# Altium schematic sheet Channel.SchDoc
size A4; DocumentNumber: 3; SheetNumber: 3; SheetTotal: 10
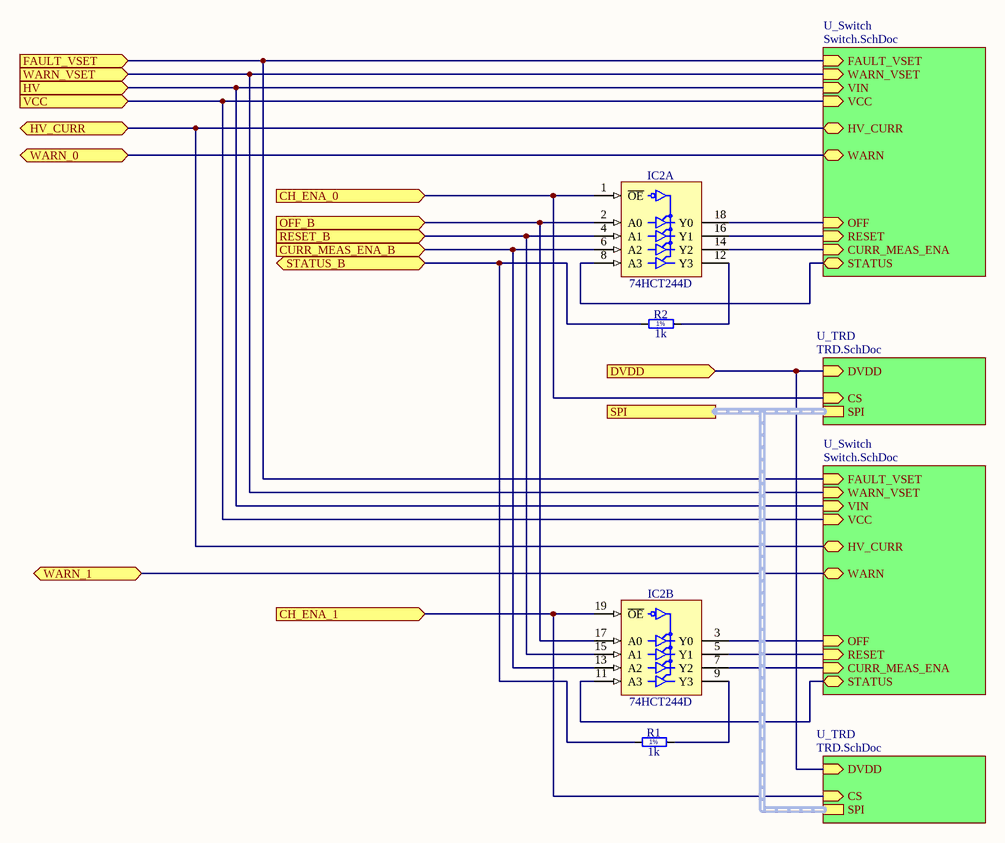
[diagram p0: Channel.SchDoc]

## Parts
IC2  74HCT244D  [SOIC127P1032X265-20N]  (parts A,B of 2)
R1  1k  [RESC2012X60N]
R2  1k  [RESC2012X60N]

## Sub-sheets
U_Switch = Switch.SchDoc: FAULT_VSET (in), WARN_VSET (in), RESET (in), VIN (in), OFF (in), HV_CURR (bidir), CURR_MEAS_ENA (in), VCC (in), WARN (bidir), STATUS (bidir)
U_Switch = Switch.SchDoc: FAULT_VSET (in), WARN_VSET (in), RESET (in), VIN (in), OFF (in), HV_CURR (bidir), CURR_MEAS_ENA (in), VCC (in), WARN (bidir), STATUS (bidir)
U_TRD = TRD.SchDoc: DVDD (in), SPI (harness SPI), CS (in)
U_TRD = TRD.SchDoc: DVDD (in), SPI (harness SPI), CS (in)

## Ports
CH_ENA_0 (in), CH_ENA_1 (in), CURR_MEAS_ENA_B (in), DVDD (in), FAULT_VSET (in), HV (in), HV_CURR (bidir), OFF_B (in), RESET_B (in), SPI (harness SPI), STATUS_B (bidir), VCC (in), WARN_0 (bidir), WARN_1 (bidir), WARN_VSET (in)

## Nets
GND: IC2.10(GND)
VCC: IC2.20(VCC)
CH_ENA_0: IC2.1(~{OE}) ; port CH_ENA_0, sheet U_TRD/CS
CH_ENA_1: IC2.19(~{OE}) ; port CH_ENA_1, sheet U_TRD/CS
CURR_MEAS_ENA_B: IC2.6(A2) IC2.13(A2) ; port CURR_MEAS_ENA_B
DVDD: port DVDD, sheet U_TRD/DVDD, sheet U_TRD/DVDD
FAULT_VSET: port FAULT_VSET, sheet U_Switch/FAULT_VSET, sheet U_Switch/FAULT_VSET
HV: port HV, sheet U_Switch/VIN, sheet U_Switch/VIN
HV_CURR: port HV_CURR, sheet U_Switch/HV_CURR, sheet U_Switch/HV_CURR
OFF_B: IC2.2(A0) IC2.17(A0) ; port OFF_B
RESET_B: IC2.4(A1) IC2.15(A1) ; port RESET_B
STATUS_B: R1.1 R2.1 ; port STATUS_B
VCC: port VCC, sheet U_Switch/VCC, sheet U_Switch/VCC  [a separate net that carries the same name]
WARN_0: port WARN_0, sheet U_Switch/WARN
WARN_1: port WARN_1, sheet U_Switch/WARN
WARN_VSET: port WARN_VSET, sheet U_Switch/WARN_VSET, sheet U_Switch/WARN_VSET
NetIC2_3: IC2.3(Y0) ; sheet U_Switch/OFF
NetIC2_5: IC2.5(Y1) ; sheet U_Switch/RESET
NetIC2_7: IC2.7(Y2) ; sheet U_Switch/CURR_MEAS_ENA
NetIC2_8: IC2.8(A3) ; sheet U_Switch/STATUS
NetIC2_9: IC2.9(Y3) R1.2
NetIC2_11: IC2.11(A3) ; sheet U_Switch/STATUS
NetIC2_12: IC2.12(Y3) R2.2
NetIC2_14: IC2.14(Y2) ; sheet U_Switch/CURR_MEAS_ENA
NetIC2_16: IC2.16(Y1) ; sheet U_Switch/RESET
NetIC2_18: IC2.18(Y0) ; sheet U_Switch/OFF

## Buses and harness runs
harness port SPI = sheet U_TRD/SPI

## Notes on the sheet
- (in symbol R0805_1K_1%_0.33W_100PPM_VISHAY_CRCW-HP) 1%

## Library data of the parts
IC2 = 74HCT244D: Octal Buffer And Line Driver with 3-State Ouputs; Part Description: Octal Buffer/Line Driver with 3-State Outputs; Manufacturer: NXP SEMICONDUCTORS; PressFit: No; Bonding: No; Part Number: 74HCT244D; Component Kind: Standard; Component Type: Standard; Device: 74HCT244D; PackageDescription: SOIC, 1.27mm pitch; 20 pin, 7.50mm W X 12.80mm L X 2.65mm H body, IPC Medium Density; Manufacturer Part Number: 74HCT244D; Pin Count: 20; Case: SOIC20; Mounted: Yes; Socket: No; SMD: Yes; Sense: No; ComponentHeight: 2.65mm; Author: CERN DEM JLC; HelpURL: \\cern.ch\dfs\Applications\Altium\Datasheets\74HCT244D.pdf; CreateDate: 27.08.2013; LatestRevisionDate: 27.08.2013
R1 R2 = R0805_1K_1%_0.33W_100PPM_VISHAY_CRCW-HP: Resistor - 1%; Part Description: 150V, Pulse Proof, High Power Thick Film Chip Resistor; Manufacturer: VISHAY DRALORIC; Manufacturer Part Number: CRCW08051K00FKEAHP; Power: 0.33W; TC: ±100ppm/°C; PressFit: No; Part Number: R0805_1K_1%_0.33W_100PPM_VISHAY_CRCW-HP; Component Kind: Standard; Component Type: Standard; Pin Count: 2; Value: 1k; Status: None; Tolerance: ±1%; Case: 0805; Mounted: Yes; Sense: No; Socket: No; SMD: Yes; Manufacturer1 ComponentHeight: 0.6mm; HelpURL: \\cern.ch\dfs\Applications\Altium\Datasheets\R0805_VISHAY_CRCW-HP e3.pdf; Author: CERN DEM JLC; CreateDate: 16.06.2010; LatestRevisionDate: 16.06.2010